# Altium schematic sheet HPW_Protect_VBAT.SchDoc: =SheetTitle
size A4; SheetTitle: High-power Bus Protection; DrawnBy: Samyar Sadat Akhavi; SheetNumber: 10; SheetTotal: 19
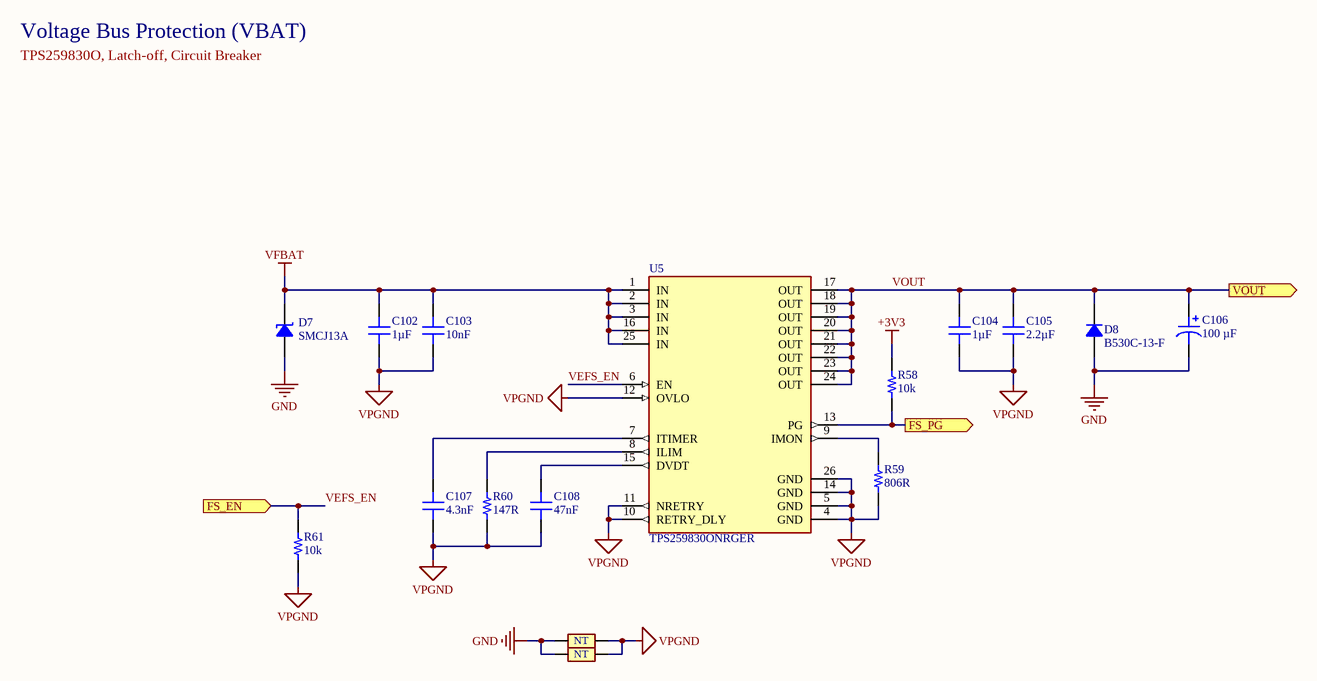
[diagram p0: HPW_Protect_VBAT.SchDoc]

## Parts
?  (no value)  (graphical)
C102  1µF  [CAP 0603_1608]
C103  10nF  [CAP 0603_1608]
C104  1µF  [CAP 0603_1608]
C105  2.2µF  [CAP 0805_2012]
C106  100 µF  [CAP ALSMD 6.6MM H7.7MM]
C107  4.3nF  [CAP 0603_1608]
C108  47nF  [CAP 0603_1608]
D7  SMCJ13A  [DO214AB SMC]
D8  B530C-13-F  [DO214AB SMC]
NT8  Net Tie  [Net_Tie_Via]  (value not drawn)  (net tie, no BOM)
NT9  Net Tie  [Net_Tie_Via]  (value not drawn)  (net tie, no BOM)
R58  10k  [RES 0603_1608]
R59  806R  [RES 0603_1608]
R60  147R  [RES 0603_1608]
R61  10k  [RES 0603_1608]
U5  TPS259830ONRGER  [VQFN24_RGE_TEX]

## Ports
FS_EN (in, see VBAT_Output[2B]), FS_PG (out, see VBAT_Output[2B]), VOUT (out, see VBAT_Output[2B])

## Nets
+3V3: R58.1
GND: C106.2 D7.1 D8.1 NT8.1 NT9.1
VFBAT: C102.2 C103.1 D7.2 U5.1(IN) U5.2(IN) U5.3(IN) U5.16(IN) U5.25(IN)
VPGND: C102.1 C103.2 C104.1 C105.1 C107.1 C108.1 NT8.2 NT9.2 R59.1 R60.1 R61.1 U5.4(GND) U5.5(GND) U5.10(RETRY_DLY) U5.11(NRETRY) U5.12(OVLO) U5.14(GND) U5.26(GND)
FS_PG: R58.2 U5.13(PG) ; port FS_PG
VEFS_EN: R61.2 U5.6(EN) ; port FS_EN
VOUT: C104.2 C105.2 C106.1 D8.2 U5.17(OUT) U5.18(OUT) U5.19(OUT) U5.20(OUT) U5.21(OUT) U5.22(OUT) U5.23(OUT) U5.24(OUT) ; port VOUT
NetC107_2: C107.2 U5.7(ITIMER)
NetC108_2: C108.2 U5.15(DVDT)
NetR59_2: R59.2 U5.9(IMON)
NetR60_2: R60.2 U5.8(ILIM)

## Notes on the sheet
- Voltage Bus Protection (VBAT)
- TPS259830O, Latch-off, Circuit Breaker
- Sub-Project:
- Size:
- Drawn By:
- Revision:
- Date:
- File:
- Sheet:
- of
- (in symbol GEN-PCBVINT0S3) NT

## Library data of the parts
? = SGR-STDTBSA4: STANDARD SCHEMATICS TITLE BLOCK
C102 C104 = GEN-CC1UT10V25KX7R603: GENERIC 0603 MLC CAPACITOR; Tolerance: ±10%; Voltage: 25V; Dielectric: X7R; Part Number: GEN-CC1UT10V25KX7R603; Value: 1µF
C103 = GEN-CC10NT10V50KX7R603: GENERIC 0603 MLC CAPACITOR; Tolerance: ±10%; Voltage: 50V; Dielectric: X7R; Part Number: GEN-CC10NT10V50KX7R603; Value: 10nF
C105 = GEN-CC2U2T10V25KX7R805: GENERIC 0805 MLC CAPACITOR; Tolerance: ±10%; Voltage: 25V; Dielectric: X7R; Part Number: GEN-CC2U2T10V25KX7R805; Value: 2.2µF
C106 = 865080445010: CAP ALUM 100UF 20% 25V SMD; manufacturer: Würth Elektronik; Impedance: 380 mOhms; Lifetime @ Temp.: 2000 Hrs @ 105°C; Polarization: Polar; Ripple Current @ High Frequency: 290 mA @ 100 kHz; Ripple Current @ Low Frequency: 188.5 mA @ 120 Hz; Surface Mount Land Size: 0.260" L x 0.260" W (6.60mm x 6.60mm); Part Number: 865080445010; Applications: General Purpose; Capacitance: 100 µF; componentlink1description: Datasheet; componentlink1url: https://katalog.we-online.de/pbs/datasheet/865080445010.pdf; componentlink2description: DigiKey Link; componentlink2url: https://www.digikey.com/en/products/detail/würth-elektronik/865080445010/5728033; Device Package: Radial, Can - SMD; Height - Seated (Max): 0.303" (7.70mm); lastupdated: 4/5/2026 8:54:41 PM; Lifecycle Status: Active; Minimum Order: 1; Mounting Type: Surface Mount; Operating Temperature: -55°C ~ 105°C; Package / Case: Radial, Can - SMD; packaging: TapeAndReel; partid: 8228; Part Status: Active; price: 0.16; series: WCAP-ASLI; Size / Dimension: 0.248" Dia (6.30mm); Supplier 1: DigiKey; Supplier Part Number 1: 732-8438-1-ND; Tolerance: ±20%; value: 100 µF; Voltage - Rated: 25 V
C107 = GEN-CC4N3T5V50KC0G603: GENERIC 0603 MLC CAPACITOR; Tolerance: ±5%; Voltage: 50V; Dielectric: C0G; Part Number: GEN-CC4N3T5V50KC0G603; Value: 4.3nF
C108 = GEN-CC47NT5V25KX7R603: GENERIC 0603 MLC CAPACITOR; Tolerance: ±5%; Voltage: 25V; Dielectric: X7R; Part Number: GEN-CC47NT5V25KX7R603; Value: 47nF
D7 = SMCJ13A: TVS DIODE 13VWM 21.5VC DO214AB; Manufacturer: Littelfuse Inc.; Current - Peak Pulse (10/1000µs): 69.8A; Power Line Protection: No; Power - Peak Pulse: 1500W (1.5kW); Type: Zener; Unidirectional Channels: 1; Voltage - Breakdown (Min): 14.4V; Voltage - Clamping (Max) @ Ipp: 21.5V; Voltage - Reverse Standoff (Typ): 13V; Part Number: SMCJ13A; Applications: General Purpose; ComponentLink1Description: Datasheet; ComponentLink1URL: https://www.littelfuse.com/products/tvs-diodes/surface-mount/~/media/electronics/datasheets/tvs_diodes/littelfuse_tvs_diode_smcj_datasheet.pdf.pdf; ComponentLink2Description: DigiKey Link; ComponentLink2URL: https://www.digikey.com/en/products/detail/littelfuse-inc/SMCJ13A/762378; LastUpdated: 4/5/2026 8:33:56 PM; Lifecycle Status: Active; Minimum Order: 1; Mounting Type: Surface Mount; Operating Temperature: -55°C ~ 150°C (TJ); Package / Case: DO-214AB, SMC; Packaging: TapeAndReel; PartId: 6718; Part Status: Active; Price: 0.16; Series: SMCJ; Supplier 1: DigiKey; Supplier Part Number 1: SMCJ13ALFCT-ND; Supplier Device Package: DO-214AB (SMCJ)
D8 = B530C-13-F: DIODE SCHOTTKY 30V 5A SMC; Manufacturer: Diodes Incorporated; Capacitance @ Vr, F: 300pF @ 4V, 1MHz; Current - Reverse Leakage @ Vr: 500 µA @ 30 V; Speed: Fast Recovery =< 500ns, > 200mA (Io); Voltage - Forward (Vf) (Max) @ If: 550 mV @ 5 A; Part Number: B530C-13-F; ComponentLink1Description: Datasheet; ComponentLink1URL: https://www.diodes.com/assets/Datasheets/ds13012.pdf; ComponentLink2Description: DigiKey Link; ComponentLink2URL: https://www.digikey.com/en/products/detail/diodes-incorporated/B530C-13-F/768770; Current - Average Rectified (Io): 5A; Diode Type: Schottky; LastUpdated: 4/5/2026 8:31:14 PM; Lifecycle Status: Active; Minimum Order: 1; Mounting Type: Surface Mount; Operating Temperature - Junction: -55°C ~ 150°C; Package / Case: DO-214AB, SMC; Packaging: CutTape; PartId: 1719; Part Status: Active; Price: 0.30; Series: -; Supplier 1: DigiKey; Supplier Part Number 1: B530C-FDICT-ND; Supplier Device Package: SMC; Voltage - DC Reverse (Vr) (Max): 30 V
NT8 NT9 = GEN-PCBVINT0S3: VIA STYLE CIRCULAR NET TIE; Part Number: GEN-PCBVINT0S3; Size Variant: 0.3mm
R58 R61 = GEN-CRR10KT1P8603: GENERIC 0603 CHIP RESISTOR; Tolerance: ±1%; Power: 0.125W; Part Number: GEN-CRR10KT1P8603; Value: 10k
R59 = GEN-CRR806T1P8603: GENERIC 0603 CHIP RESISTOR; Tolerance: ±1%; Power: 0.125W; Part Number: GEN-CRR806T1P8603; Value: 806R
R60 = GEN-CRR147T1P8603: GENERIC 0603 CHIP RESISTOR; Tolerance: ±1%; Power: 0.125W; Part Number: GEN-CRR147T1P8603; Value: 147R
U5 = TPS259830ONRGER: 2.7-V TO 26-V, 2.7-M 18-A INTEGR; Manufacturer: Texas Instruments; Copyright: Copyright (C) 2025 Ultra Librarian. All rights reserved.; Part Number: TPS259830ONRGER; Supplier 1: DigiKey; Supplier Part Number 1: 296-TPS259830ONRGERCT-ND